# Altium schematic sheet CONTROL.SchDoc
size A3
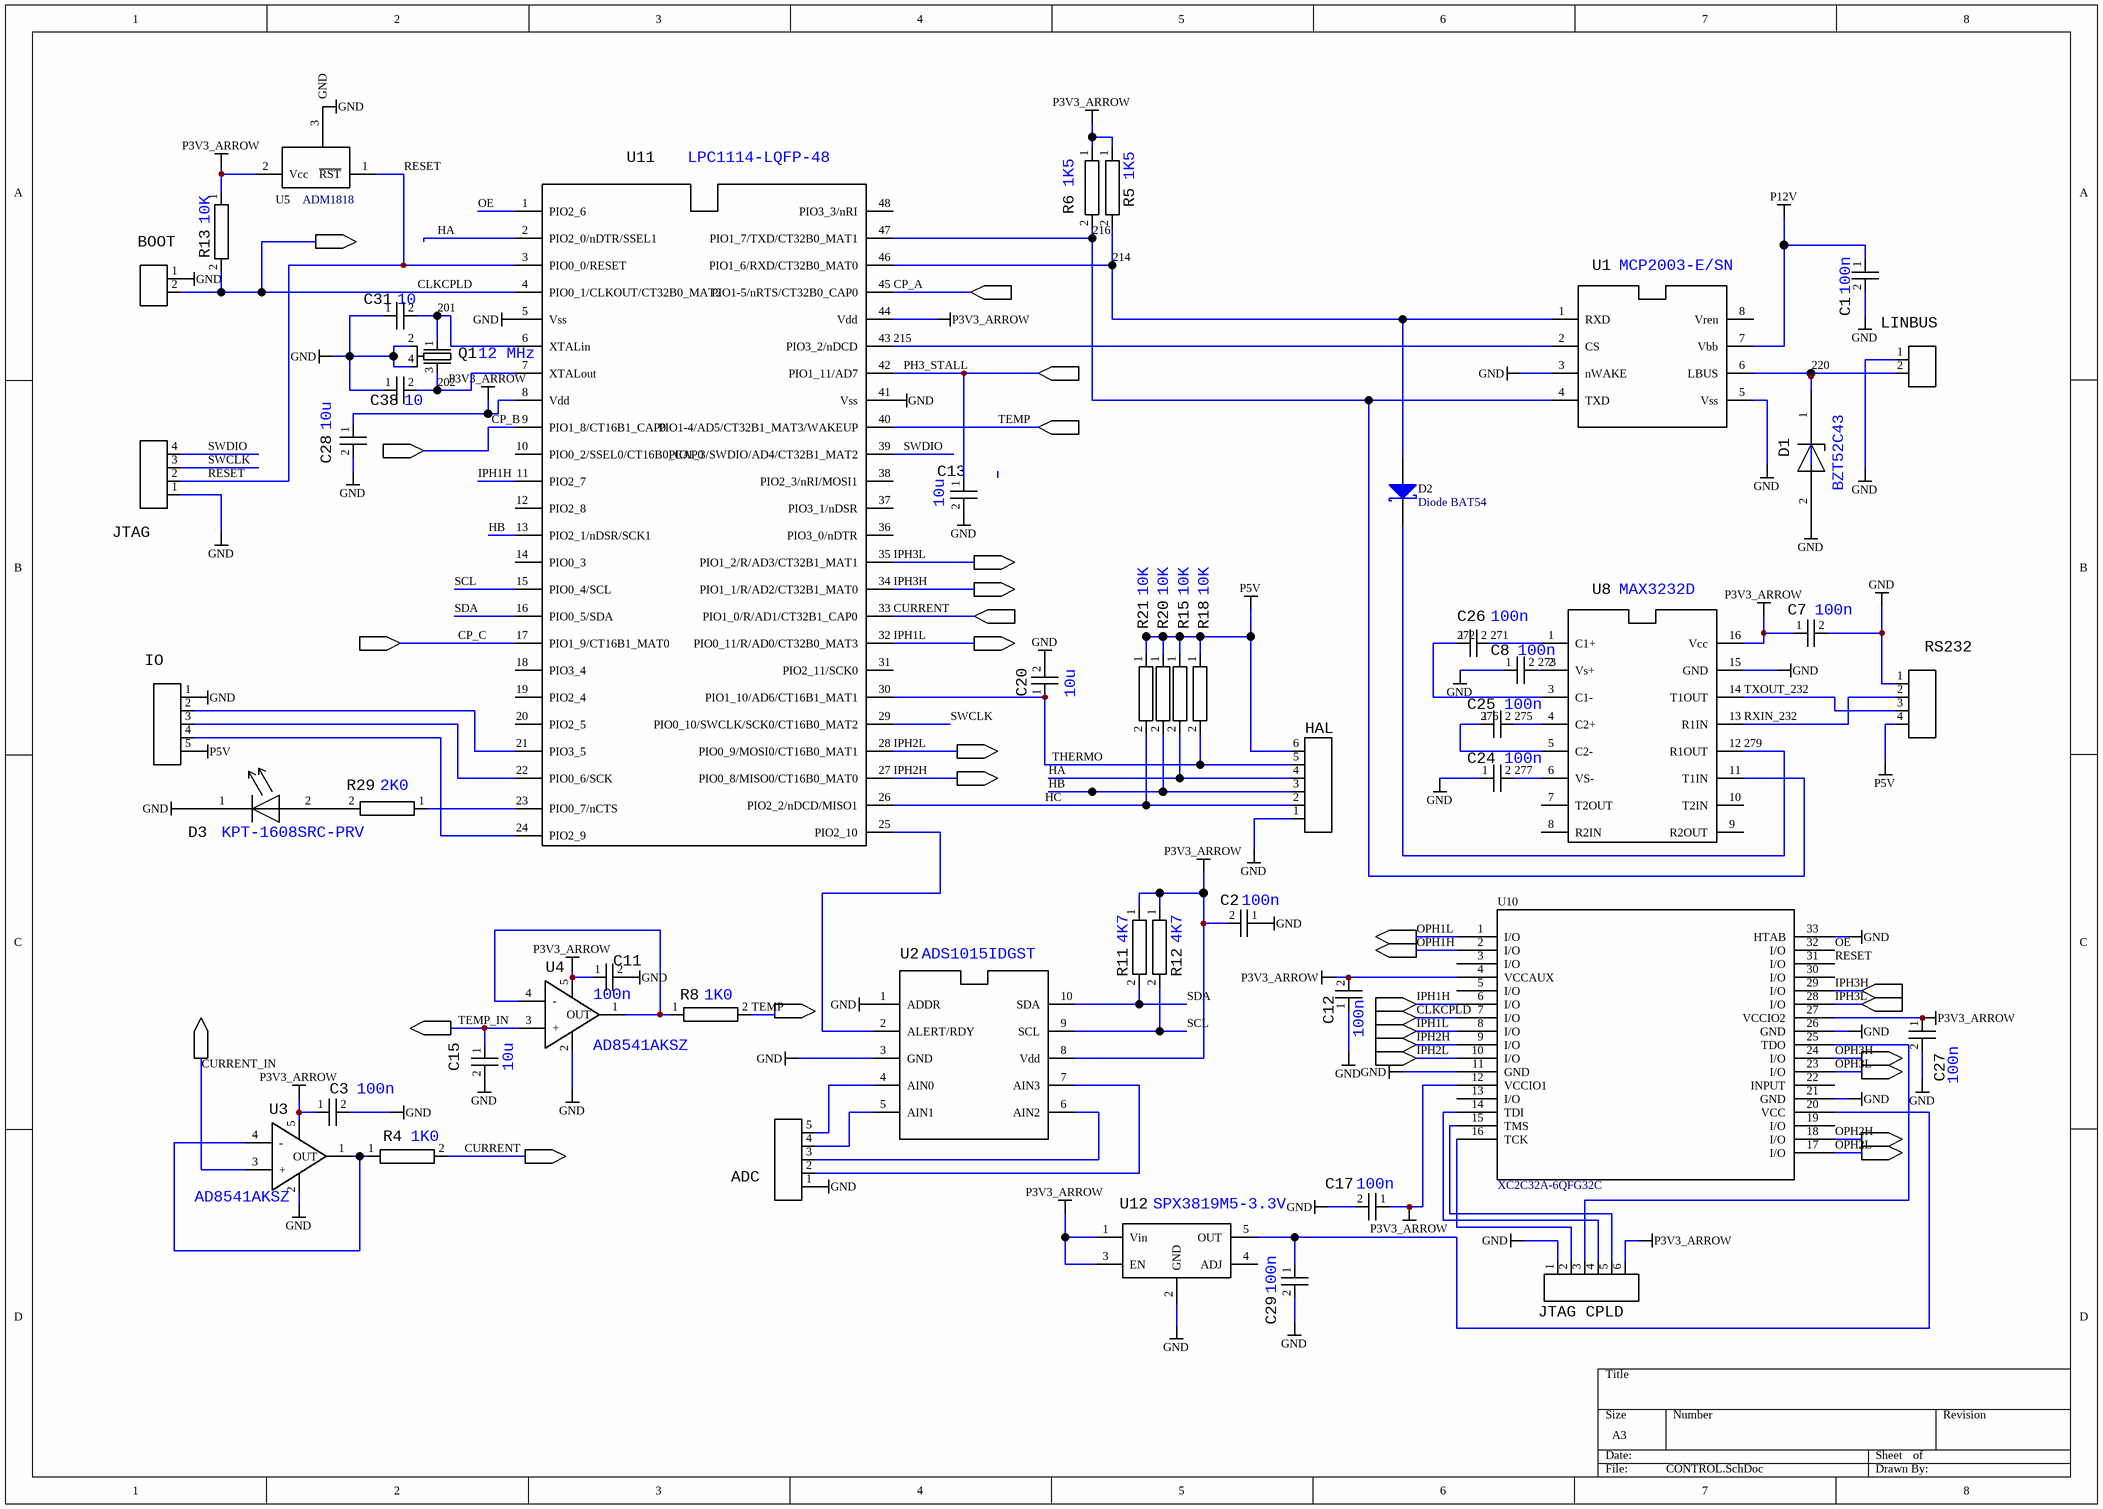
[diagram p0: CONTROL.SchDoc]

## Parts
(Parts that share a designator on the sheet are numbered #1, #2 ... from top to bottom, then left to right.)
?#1  SIGNALREF (externalout)  (value not drawn)  (graphical)
?#2  SIGNALREF (externalin)  (value not drawn)  (graphical)
?#3  SIGNALREF (externalin)  (value not drawn)  (graphical)
?#4  SIGNALREF (externalin)  (value not drawn)  (graphical)
?#5  SIGNALREF (externalin)  (value not drawn)  (graphical)
?#6  SIGNALREF (externalout)  (value not drawn)  (graphical)
?#7  SIGNALREF (externalout)  (value not drawn)  (graphical)
?#8  SIGNALREF (externalin)  (value not drawn)  (graphical)
?#9  SIGNALREF (externalin)  (value not drawn)  (graphical)
?#10  SIGNALREF (externalout)  (value not drawn)  (graphical)
?#11  SIGNALREF (externalout)  (value not drawn)  (graphical)
?#12  SIGNALREF (externalout)  (value not drawn)  (graphical)
?#13  SIGNALREF (externalin)  (value not drawn)  (graphical)
?#14  SIGNALREF (externalin)  (value not drawn)  (graphical)
?#15  SIGNALREF (externalin)  (value not drawn)  (graphical)
?#16  SIGNALREF (externalin)  (value not drawn)  (graphical)
?#17  SIGNALREF (externalin)  (value not drawn)  (graphical)
?#18  SIGNALREF (externalout)  (value not drawn)  (graphical)
?#19  SIGNALREF (externalin)  (value not drawn)  (graphical)
?#20  SIGNALREF (externalout)  (value not drawn)  (graphical)
?#21  SIGNALREF (externalin)  (value not drawn)  (graphical)
?#22  SIGNALREF (externalin)  (value not drawn)  (graphical)
?#23  SIGNALREF (externalout)  (value not drawn)  (graphical)
?#24  SIGNALREF (externalin)  (value not drawn)  (graphical)
?#25  SIGNALREF (externalin)  (value not drawn)  (graphical)
?#26  SIGNALREF (externalin)  (value not drawn)  (graphical)
?#27  SIGNALREF (externalin)  (value not drawn)  (graphical)
?#28  SIGNALREF (externalout)  (value not drawn)  (graphical)
?#29  SIGNALREF (externalin)  (value not drawn)  (graphical)
ADC  HEADER 5P S MALE  [CON-SRS-5-0254]  (value not drawn)
BOOT  HEADER 2P S MALE  [con-srs-2-0254]  (value not drawn)
C1  100n  [1608[0603]]
C2  100n  [1608[0603]]
C3  100n  [1608[0603]]
C7  100n  [1608[0603]]
C8  100n  [1608[0603]]
C11  100n  [1608[0603]]
C12  100n  [1608[0603]]
C13  10u  [0805_N]
C15  10u  [0805_N]
C17  100n  [1608[0603]]
C20  10u  [0805_N]
C24  100n  [1608[0603]]
C25  100n  [1608[0603]]
C26  100n  [1608[0603]]
C27  100n  [1608[0603]]
C28  10u  [0805_N]
C29  100n  [1608[0603]]
C31  10  [1608[0603]]
C38  10  [1608[0603]]
D1  BZT52C43  [SOD123]
D2  Diode BAT54  [SOT-23_N]
D3  KPT-1608SRC-PRV
HAL  HEADER 6P S MALE  [con-srs-6-0254]  (value not drawn)
IO  HEADER 5P S MALE  [CON-SRS-5-0254]  (value not drawn)
JTAG  HEADER 4P S MALE  [con-srs-4-0254]  (value not drawn)
JTAG_CPLD  HEADER 6P S MALE  [con-srs-6-0254]  (value not drawn)
LINBUS  HEADER 2P S MALE  [con-srs-2-0254]  (value not drawn)
Q1  12 MHz  [QUARTZ SMD QKT (QKT)]
R4  1K0  [1608[0603]]
R5  1K5  [1608[0603]]
R6  1K5  [1608[0603]]
R8  1K0  [1608[0603]]
R11  4K7  [1608[0603]]
R12  4K7  [1608[0603]]
R13  10K  [1608[0603]]
R15  10K  [1608[0603]]
R18  10K  [1608[0603]]
R20  10K  [1608[0603]]
R21  10K  [1608[0603]]
R29  2K0  [1608[0603]]
RS232  HEADER 4P S MALE  [con-srs-4-0254]  (value not drawn)
U1  MCP2003-E/SN
U2  ADS1015IDGST  [VSSOP-10 (GST)]
U3  AD8541AKSZ
U4  AD8541AKSZ
U5  ADM1818  [SOT-23_N]
U8  MAX3232D
U10  XC2C32A-6QFG32C  [32-QFN]
U11  LPC1114-LQFP-48  [LQFP48_N]
U12  SPX3819M5-3.3V

## Nets
GND: ADC.1 BOOT.1 C1.2 C2.1 C3.2 C7.2 C8.1 C11.2 C12.1 C13.2 C15.2 C17.2 C20.2 C24.1 C27.2 C28.2 C29.2 C31.1 C38.1 D3.1 HAL.1 IO.1 JTAG.1 JTAG_CPLD.1 LINBUS.1 Q1.2 Q1.4 RS232.1 U1.3(nWAKE) U1.5(Vss) U2.1(ADDR) U2.3(GND) U3.2(GND) U4.2(GND) U8.15(GND) U10.11(GND) U10.21(GND) U10.26(GND) U10.33(HTAB) U11.5(Vss) U11.41(Vss) U12.2(GND)
P3V3_ARROW: C2.2 C3.1 C7.1 C11.1 C12.2 C17.1 C27.1 C28.1 JTAG_CPLD.6 R5.1 R6.1 R11.1 R12.1 R13.1 U2.8(Vdd) U3.5(Vcc) U4.5(Vcc) U5.2(Vcc) U8.16(Vcc) U10.4(VCCAUX) U10.12(VCCIO1) U10.27(VCCIO2) U11.8(Vdd) U11.44(Vdd) U12.1(Vin) U12.3(EN)
P5V: HAL.6 IO.5 R15.1 R18.1 R20.1 R21.1 RS232.4
P12V: C1.1 U1.7(Vbb)
201: C31.2 Q1.1 U11.6(XTALin)
202: C38.2 Q1.3 U11.7(XTALout)
214: D2.1(A) R5.2 U1.1(RXD) U11.46(PIO1_6/RXD/CT32B0_MAT0)
215: U1.2(CS) U11.43(PIO3_2/nDCD)
216: R6.2 U1.4(TXD) U8.11(T1IN) U11.47(PIO1_7/TXD/CT32B0_MAT1)
220: D1.1 LINBUS.2 U1.6(LBUS)
271: C26.2 U8.1(C1+)
272: C26.1 U8.3(C1-)
273: C8.2 U8.2(Vs+)
275: C25.2 U8.4(C2+)
276: C25.1 U8.5(C2-)
277: C24.2 U8.6(VS-)
279: D2.3(K) U8.12(R1OUT)
CLKCPLD: ?#1.1 ?#19.1 BOOT.2 R13.2 U10.7(I/O) U11.4(PIO0_1/CLKOUT/CT32B0_MAT2)
CP_A: ?#2.1 U11.45(PIO1-5/nRTS/CT32B0_CAP0)
CP_B: ?#5.1 U11.9(PIO1_8/CT16B1_CAP0)
CP_C: ?#9.1 U11.17(PIO1_9/CT16B1_MAT0)
CURRENT: ?#8.1 ?#28.1 R4.2 U11.33(PIO1_0/R/AD1/CT32B1_CAP0)
CURRENT_IN: ?#23.1 U3.3(+)
HA: HAL.4 R15.2 U11.2(PIO2_0/nDTR/SSEL1)
HB: HAL.3 R20.2 U11.13(PIO2_1/nDSR/SCK1)
HC: HAL.2 R21.2 U11.26(PIO2_2/nDCD/MISO1)
IPH1H: ?#16.1 U10.6(I/O) U11.11(PIO2_7)
IPH1L: ?#10.1 ?#21.1 U10.8(I/O) U11.32(PIO0_11/R/AD0/CT32B0_MAT3)
IPH2H: ?#12.1 ?#22.1 U10.9(I/O) U11.27(PIO0_8/MISO0/CT16B0_MAT0)
IPH2L: ?#11.1 ?#24.1 U10.10(I/O) U11.28(PIO0_9/MOSI0/CT16B0_MAT1)
IPH3H: ?#7.1 ?#15.1 U10.29(I/O) U11.34(PIO1_1/R/AD2/CT32B1_MAT0)
IPH3L: ?#6.1 ?#17.1 U10.28(I/O) U11.35(PIO1_2/R/AD3/CT32B1_MAT1)
OE: U10.32(I/O) U11.1(PIO2_6)
OPH1H: U10.2(I/O)
OPH1L: U10.1(I/O)
OPH2H: U10.18(I/O)
OPH2L: U10.17(I/O)
OPH3H: U10.24(I/O)
OPH3L: U10.23(I/O)
PH3_STALL: ?#3.1 C13.1 U11.42(PIO1_11/AD7)
RESET: JTAG.2 U5.1(~{RST}) U10.31(I/O) U11.3(PIO0_0/RESET)
RXIN_232: RS232.2 U8.13(R1IN)
SCL: R12.2 U2.9(SCL) U11.15(PIO0_4/SCL)
SDA: R11.2 U2.10(SDA) U11.16(PIO0_5/SDA)
SWCLK: JTAG.3 U11.29(PIO0_10/SWCLK/SCK0/CT16B0_MAT2)
SWDIO: JTAG.4 U11.39(PIO1_3/SWDIO/AD4/CT32B1_MAT2)
TEMP: ?#4.1 ?#18.1 R8.2 U11.40(PIO1-4/AD5/CT32B1_MAT3/WAKEUP)
TEMP_IN: ?#20.1 C15.1 U4.3(+)
THERMO: C20.1 HAL.5 R18.2 U11.30(PIO1_10/AD6/CT16B1_MAT1)
TXOUT_232: RS232.3 U8.14(T1OUT)
NetADC_2: ADC.2 U2.7(AIN3)
NetADC_3: ADC.3 U2.6(AIN2)
NetADC_4: ADC.4 U2.5(AIN1)
NetADC_5: ADC.5 U2.4(AIN0)
NetC29_1: C29.1 U10.20(VCC) U12.5(OUT)
NetD3_2: D3.2 R29.2
NetIO_2: IO.2 U11.21(PIO3_5)
NetIO_3: IO.3 U11.22(PIO0_6/SCK)
NetIO_4: IO.4 U11.24(PIO2_9)
NetJTAG_CPLD_2: JTAG_CPLD.2 U10.16(TCK)
NetJTAG_CPLD_3: JTAG_CPLD.3 U10.25(TDO)
NetJTAG_CPLD_4: JTAG_CPLD.4 U10.14(TDI)
NetJTAG_CPLD_5: JTAG_CPLD.5 U10.15(TMS)
NetR4_1: R4.1 U3.1(OUT) U3.4(-)
NetR8_1: R8.1 U4.1(OUT) U4.4(-)
NetR29_1: R29.1 U11.23(PIO0_7/nCTS)
NetU2_2: U2.2(ALERT/RDY) U11.25(PIO2_10)

Not connected (* = marked no-connect by the designer): ?#13 1; ?#14 1; ?#25 1; ?#26 1; ?#27 1; ?#29 1; D1 2; U1 8(Vren); U5 3(GND); U8 7(T2OUT) 8(R2IN) 9(R2OUT) 10(T2IN); U10 3(I/O) 5(I/O) 13(I/O) 19(I/O) 22(INPUT) 30(I/O); U11 10(PIO0_2/SSEL0/CT16B0_CAP0) 12(PIO2_8) 14(PIO0_3) 18(PIO3_4) 19(PIO2_4) 20(PIO2_5) 31(PIO2_11/SCK0) 36(PIO3_0/nDTR) 37(PIO3_1/nDSR) 38(PIO2_3/nRI/MOSI1) 48(PIO3_3/nRI); U12 4(ADJ)

## Notes on the sheet
- Labels drawn without touching a wire or pin: GND

## Library data of the parts
ADC IO = HEADER 5P S MALE: HEADER SINGLE ROW 4P STRAIGHT MALE; Elec_type: ON_BOARD_CONNECTOR; (OldCtfName): (CTF_OLD_NAME_INVALID)
BOOT LINBUS = HEADER 2P S MALE: HEADER SINGLE ROW 2P STRAIGHT MALE; Elec_type: ON_BOARD_CONNECTOR; (OldCtfName): (CTF_OLD_NAME_INVALID)
C1-C3 C7 C8 C11 C12 C17 C24-C27 C29 = C100n-10%-0603: 100n Surface mount CAP 10% 25V; (OldCtfName): (CTF_OLD_NAME_INVALID); Value: 100n; Tolerance: 10%; Voltage: 25V
C13 C15 C20 C28 = C10u-10%-0805: 10u Surface mount CAP 0805 10% 25V; (OldCtfName): (CTF_OLD_NAME_INVALID); Value: 10u; Tolerance: 10%; Voltage: 25V
C31 C38 = C10-10%-0603: 10p Surface mount CAP 10% 25V; (OldCtfName): (CTF_OLD_NAME_INVALID); Value: 10; Tolerance: 10%; Voltage: 25V
D1 = BZT52C43: ZENER DIODE 43V; Manufacturer: DIODES; (OldCtfName): (CTF_OLD_NAME_INVALID); Value: BZT52C43
D2 = Diode BAT17: Silicon RF Schottky Diode for Mixer Applications in the VHF/UHF Range; Note: Pin 2 is not connected and not drawn.; Published: 21-Mar-2003; LatestRevisionDate: 29-May-2009; LatestRevisionNote: IPC-7351 Footprint Added.; DatasheetVersion: Oct-1999; PackageVersion: Sep-2001; PackageReference: SOT-23; Publisher: Altium Limited; PackageDescription: 3-Pin SOT-23 Package 0.95 mm Pitch, 2.5 mm Lead Span; ComponentLink1Description: Manufacturer Link; ComponentLink1URL: http://www.infineon.com/; ComponentLink2Description: Datasheet; ComponentLink2URL: http://www.infineon.com/upload/Document/cmc_upload/documents/009/363/bat17series.pdf
D3 = KPT-1608SRC-PRV: LED SMD RED        0603; Manufacturer: KINGBRIGHT; (OldCtfName): (CTF_OLD_NAME_INVALID); Value: KPT-1608SRC-PRV
HAL JTAG_CPLD = HEADER 6P S MALE: HEADER SINGLE ROW 6P STRAIGHT MALE; Elec_type: ON_BOARD_CONNECTOR; (OldCtfName): (CTF_OLD_NAME_INVALID)
JTAG RS232 = HEADER 4P S MALE: HEADER SINGLE ROW 4P STRAIGHT MALE; Elec_type: ON_BOARD_CONNECTOR; (OldCtfName): (CTF_OLD_NAME_INVALID)
Q1 = Q-12MHz-QKT_SMD: Quartz resonator QKT SMD case; (OldCtfName): (CTF_OLD_NAME_INVALID); Value: 12 MHz
R4 R8 = R1K0-1%-0603: 1K0 SMD 0603 1%; Wattage: 0.065W; (OldCtfName): (CTF_OLD_NAME_INVALID); Value: 1K0; Tolerance: 1%
R5 R6 = R1K5-1%-0805: 1K5 SMD 0805 1%; Wattage: 0.25W; (OldCtfName): (CTF_OLD_NAME_INVALID); Value: 1K5; Tolerance: 1%
R11 R12 = R4K7-1%-0603: 4K7 SMD 0603 1%; Wattage: 0.065W; (OldCtfName): (CTF_OLD_NAME_INVALID); Value: 4K7; Tolerance: 1%
R13 R15 R18 R20 R21 = R10K-1%-0603: 10K SMD 0603 1%; Wattage: 0.065W; (OldCtfName): (CTF_OLD_NAME_INVALID); Value: 10K; Tolerance: 1%
R29 = R2K0-1%-0603: 2K0 SMD 0603 1%; Wattage: 0.065W; (OldCtfName): (CTF_OLD_NAME_INVALID); Value: 2K0; Tolerance: 1%
U1 = MCP2003-E/SN: LIN DRIVER; Manufacturer: MICROCHIP; (OldCtfName): (CTF_OLD_NAME_INVALID); Value: MCP2003-E/SN
U2 = ADS1015IDGST: 4 CHAN AD CONVERTER; Manufacturer: TI; (OldCtfName): (CTF_OLD_NAME_INVALID); Value: ADS1015IDGST
U3 U4 = AD8541AKSZ: RAIL-TO-RAIL OPERATIONAL AMP; Manufacturer: ANALOG DEVICES; (OldCtfName): (CTF_OLD_NAME_INVALID); Value: AD8541AKSZ
U5 = ADM1818: MCU Reset IC; Note: Pin 2 is not connected and not drawn.; PackageVersion: Sep-2001; PackageReference: SOT-23; PackageDescription: 3-Pin SOT-23 Package 0.95 mm Pitch, 2.5 mm Lead Span; Published: 21-Mar-2003; LatestRevisionDate: 29-May-2009; LatestRevisionNote: IPC-7351 Footprint Added.; DatasheetVersion: Oct-1999
U8 = MAX232D: RS-232 TRANSCEIVER; Manufacturer: TEXAS; thm_power_diss: 0.2275; (OldCtfName): (CTF_OLD_NAME_INVALID); Value: MAX3232D
U10 = XC2C32A-6QFG32C: Imported; Vendor: Xilinx Inc; Programmable_Type: In System Programmable; Number_of_Macrocells: 32; Number_of_I_/O: 21; Operating_Temperature: 0Â°C ~ 70Â°C; Names_Registered_&amp;_Trademark_Names: CoolRunner II; Voltage: 1.8V; Memory_Type: CMOS; Delay_Time_tpd(1)_Max: 5.5ns; Voltage_Supply_-_Internal: 1.7 V ~ 1.9 V; Number_of_Logic_Elements/Blocks: 2; Number_of_Gates: 750; Mounting_Type: Surface Mount; C: Copyright (C) 2015 Accelerated Designs. All rights reserved; DigiKeyPartNumber: 122-1412-ND; Manufacturer_Part_Number: XC2C32A-6QFG32C; Quantity_Available: 6031; Copyright: Copyright (C) 2015 Accelerated Designs. All rights reserved; DataSheet: http://www.xilinx.com/support/documentation/data_sheets/ds310.pdf; Number_of_Logic_Blocks/Elements: -; Package_/_Case: 32-VFQFN Exposed Pad; Features: Programmable; Packaging: Tray; Names,_Registered_&amp;_Trademark_Names: CoolRunner II; Supplier_Device_Package: 32-QFN Exposed Pad (5x5); Value: Value; Type: Type; RefDes: RefDes
U11 = LPC1114-LQFP-48: NXP ARM 32BIT MPU; (OldCtfName): (CTF_OLD_NAME_INVALID); Value: LPC1114-LQFP-48; Manufacturer: NXP
U12 = SPX1819M5-3.3V: POS VOLTAGE REGULATOR FIXED 3.3V; Manufacturer: EXAR; (OldCtfName): (CTF_OLD_NAME_INVALID); Value: SPX3819M5-3.3V